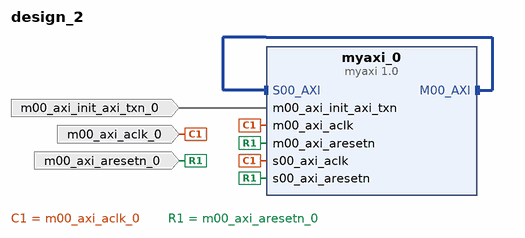
[diagram p0: block diagram of the top level]
# Vivado block design design_2, xcku060_CIV-ffva1156-2-e, Vivado 2022.2
create_bd_design design_2

create_bd_port -dir I -type clk m00_axi_aclk_0
create_bd_port -dir I -type rst m00_axi_aresetn_0
create_bd_port -dir I m00_axi_init_axi_txn_0

create_bd_cell -type ip -vlnv xilinx.com:user:myaxi:1.0 myaxi_0

# ---- connections ----

connect_bd_intf_net [get_bd_intf_pins myaxi_0/S00_AXI] [get_bd_intf_pins myaxi_0/M00_AXI]
connect_bd_net -net m00_axi_aclk_0_1 [get_bd_ports m00_axi_aclk_0] [get_bd_pins myaxi_0/m00_axi_aclk] [get_bd_pins myaxi_0/s00_axi_aclk]
connect_bd_net -net m00_axi_aresetn_0_1 [get_bd_ports m00_axi_aresetn_0] [get_bd_pins myaxi_0/m00_axi_aresetn] [get_bd_pins myaxi_0/s00_axi_aresetn]
connect_bd_net -net m00_axi_init_axi_txn_0_1 [get_bd_ports m00_axi_init_axi_txn_0] [get_bd_pins myaxi_0/m00_axi_init_axi_txn]

validate_bd_design
save_bd_design
